# Altium schematic sheet Regulador_LDO.SchDoc
size A4; SheetNumber: 2; SheetTotal: 6
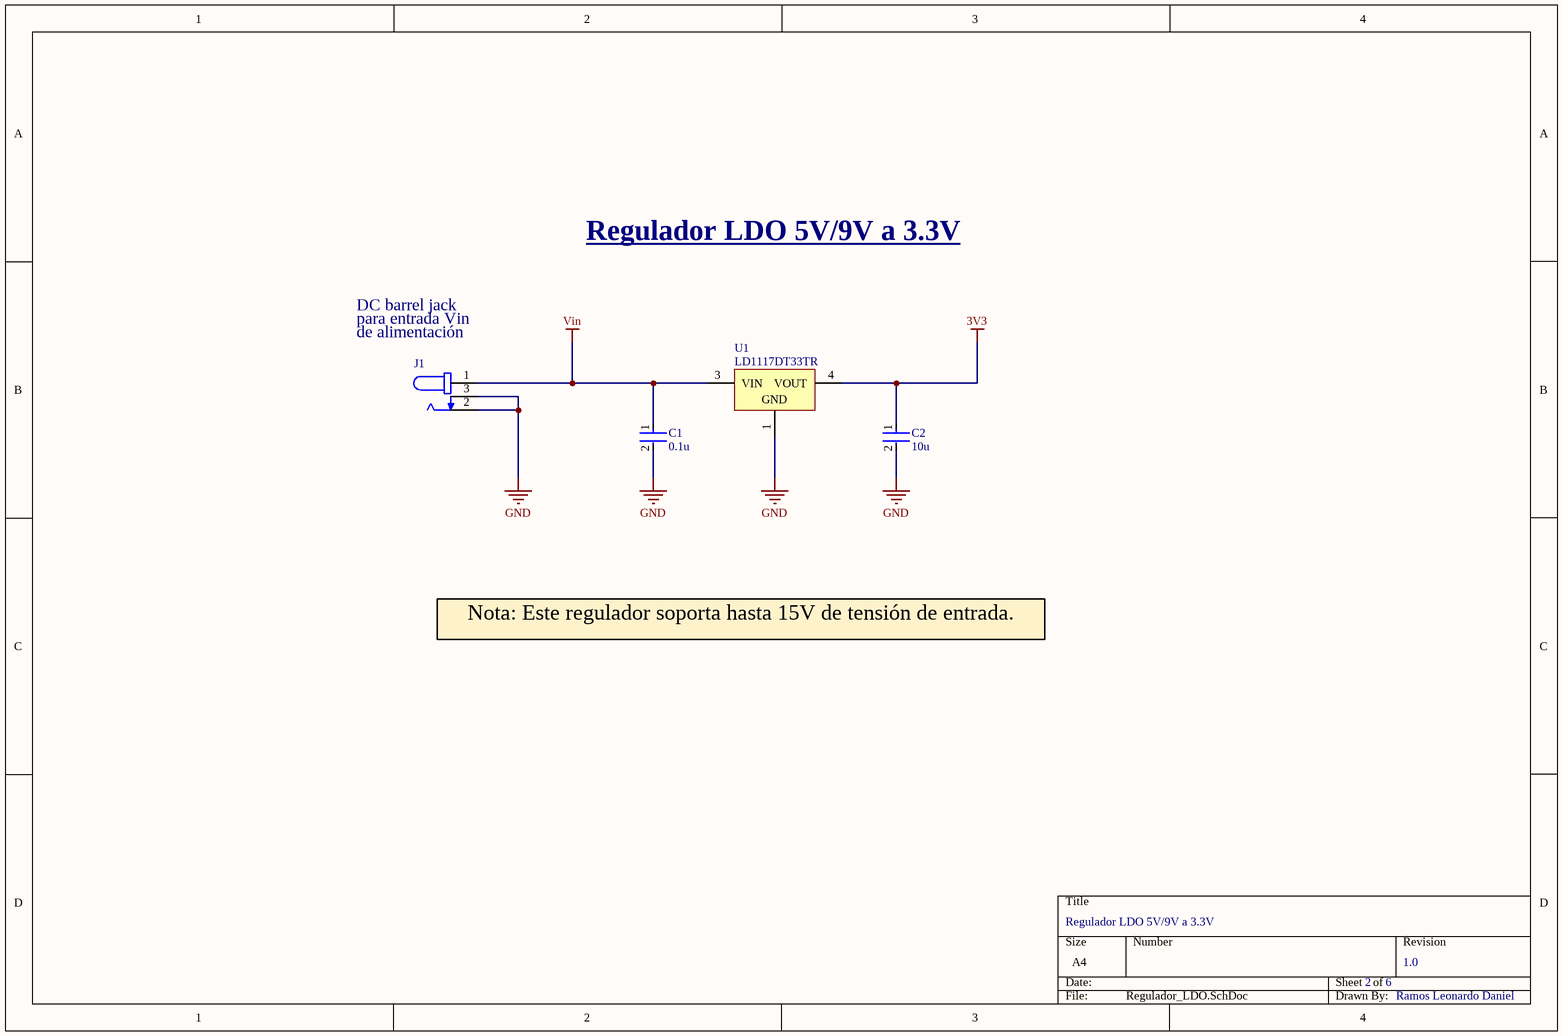
[diagram p0: Regulador_LDO.SchDoc]

## Parts
C1  0.1u  [FP-GRM21B-0_1-IPC_B]
C2  10u  [FP-C0805C106J8RACAUTO-MFG]
J1  DCJ200-10-A-XX-K_REVA  [GCT_DCJ200-10-A-XX-K_REVA]  (value not drawn)
U1  LD1117DT33TR  [TO-252_N]

## Nets
3V3: C2.1 U1.4(VOUT)
GND: C1.2 C2.2 J1.2 J1.3 U1.1(GND)
Vin: C1.1 J1.1 U1.3(VIN)

## Notes on the sheet
- Regulador LDO 5V/9V a 3.3V
- DC barrel jack
- para entrada Vin
- (near J1) de alimentación
- Nota: Este regulador soporta hasta 15V de tensión de entrada.
- 2
- 6
- 1.0
- Ramos Leonardo Daniel

## Library data of the parts
C1 = CMP-06035-037063-1: Chip Multilayer Ceramic Capacitors for General Purpose, 0805, 0.10uF, U2J, -750ppm/°C, 5%, 10V; Capacitance: 100nF; Depth: 1.25mm; Voltage Rating (DC): 10V; Voltage Rating: 10V; Length: 2mm; Max Operating Temperature: 125°C; Thickness: 0.053inch; Dielectric: U2J; Termination: SMD/SMT; Package Quantity: 3000; Packaging: Tape and Reel; Case Code (Metric): 2012; Tolerance: 5%; Case Code (Imperial): 0805; Case/Package: 0805; Mount: Surface Mount; Width: 0.049inch; Height: 1.25mm; Radiation Hardening: No; Min Operating Temperature: -55°C
C2 = CMP-03020-034708-1: CAP CER 10UF 10V X7R 0805; Tolerance: 5%; Mount: Surface Mount; Capacitance: 10uF; Voltage Rating: 10V; Max Operating Temperature: 125°C; Min Operating Temperature: -55°C; Case/Package: 0805; RoHS Compliant: Yes; Packaging: Tape and Reel; Case Code (Imperial): 0805; Case Code (Metric): 2012; Ratings: AEC-Q200
J1 = DCJ200-10-A-XX-K_REVA: Power Barrel Connector Jack 2.05mm ID (0.081), 5.50mm OD (0.217) Through Hole, Right Angle; MF: Global Connector Technology; MP: DCJ200-10-A-K1-K; SnapEDA_Link: https://www.snapeda.com/parts/DCJ200-10-A-K1-K/Global+Connector+Technology/view-part/?ref=snap; Package: None; Value: *; Check_prices: https://www.snapeda.com/parts/DCJ200-10-A-K1-K/Global+Connector+Technology/view-part/?ref=eda
U1 = CMP-0244-00088-1: Fixed Low Drop Positive Voltage Regulator, 3.3V, 3-Pin DPAK, Tape and Reel; ComponentLink1Description: Manufacturer URL; PackageVersion: 2011; PackageReference: TO-252; ComponentLink2Description: Datasheet; ComponentLink1URL: http://www.st.com; DatasheetVersion: 1/11/2011; PackageDescription: 3-Pin Transistor Outline Package 2.28 mm Pitch, 9.7 mm Lead Span (DPAK); ComponentLink2URL: http://www.st.com/internet/com/TECHNICAL_RESOURCES/TECHNICAL_LITERATURE/DATASHEET/CD00000544.pdf